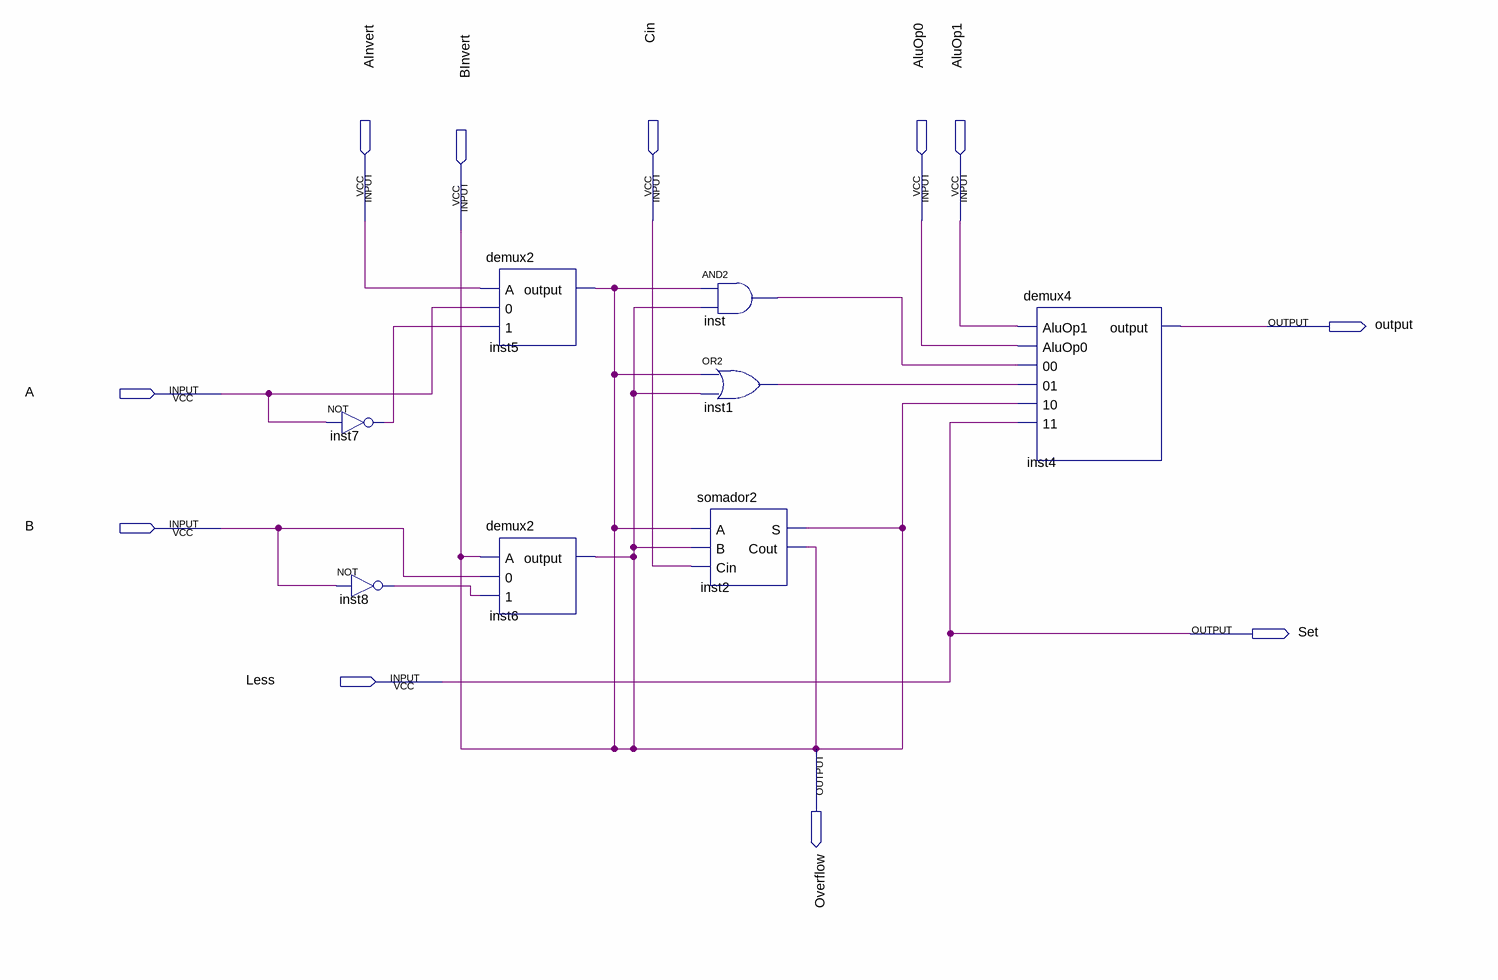
[diagram p0: schematic sheet]
// Quartus schematic ula1fim.bdf as structural Verilog: 8 symbols, 11 pins
module ula1fim (
  input  AInvert,
  input  Cin,
  input  AluOp0,
  input  AluOp1,
  input  BInvert,
  input  A,
  input  B,
  input  Less,
  output \output ,
  output Set,
  output Overflow
);

  wire inst1_out, inst7_out, inst8_out, inst_out;

  not inst7 (inst7_out, A);
  not inst8 (inst8_out, B);
  demux2 inst5 (.A(AInvert), .\0 (A), .\1 (inst7_out), .\output (BInvert));
  demux2 inst6 (.A(BInvert), .\0 (B), .\1 (inst8_out), .\output (BInvert));
  somador2 inst2 (.A(BInvert), .B(BInvert), .Cin(Cin), .S(BInvert), .Cout(BInvert));
  and inst (inst_out, BInvert, BInvert);
  or inst1 (inst1_out, BInvert, BInvert);
  demux4 inst4 (
    .AluOp1(AluOp1), .AluOp0(AluOp0), .\00 (inst_out), .\01 (inst1_out), .\10 (BInvert), .\11 (Less),
    .\output (\output ));

  assign Overflow = BInvert;
  assign Set = Less;
endmodule
